# Altium schematic sheet HCM_wiring_diagram.SchDoc
size A; SheetNumber: 2; SheetTotal: 2
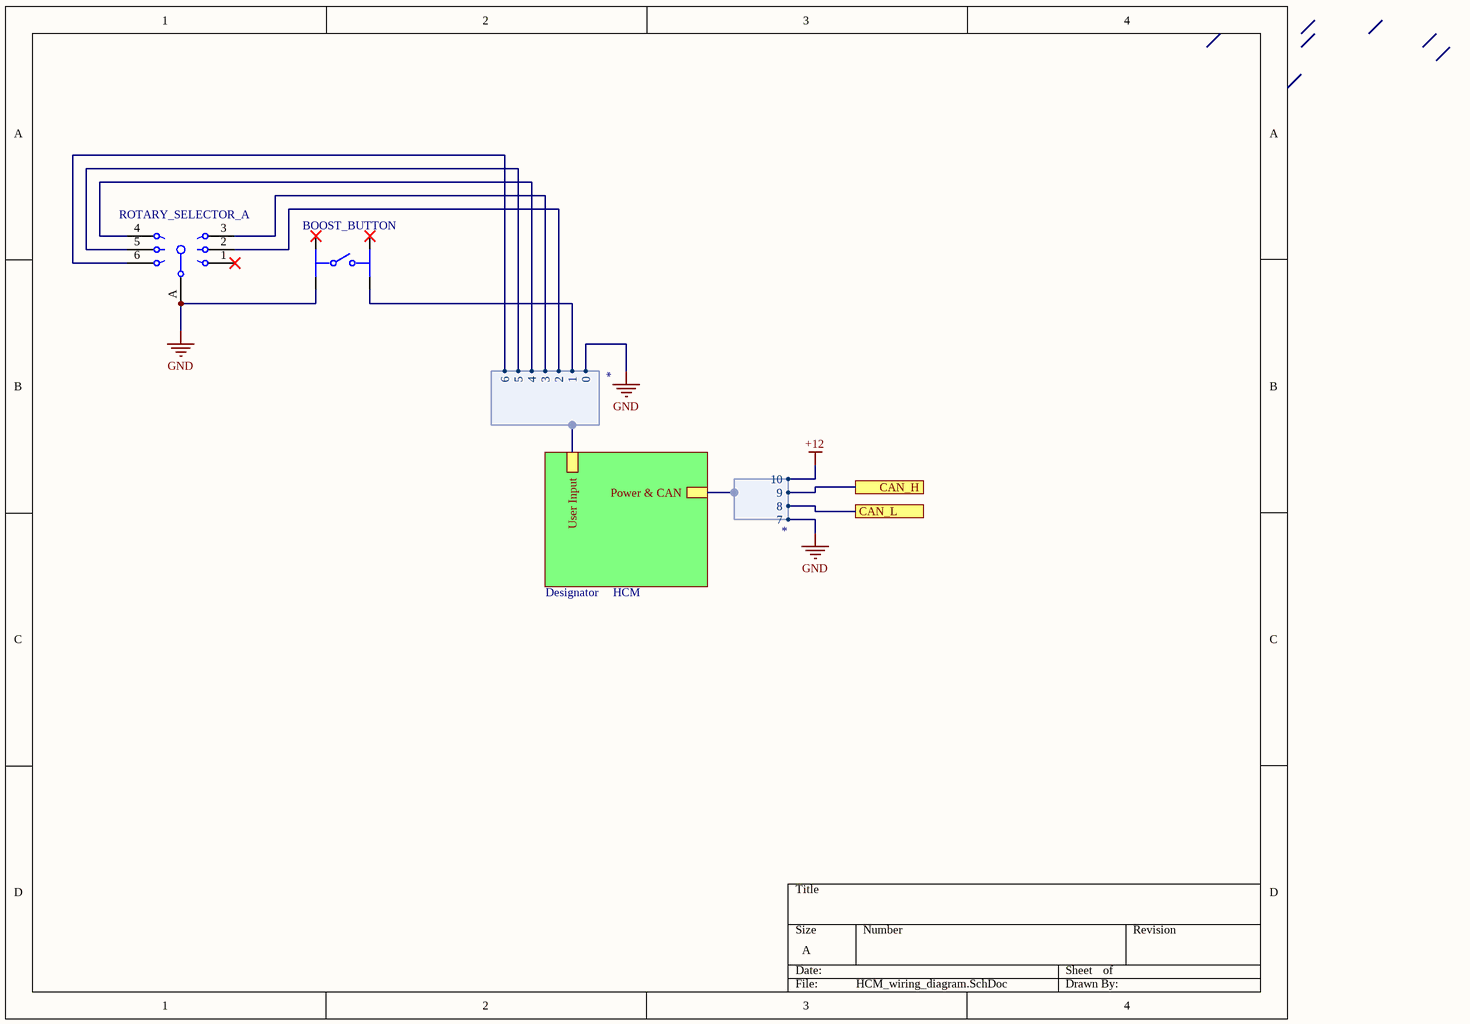
[diagram p0: HCM_wiring_diagram.SchDoc]

## Parts
BOOST_BUTTON  ESE-20C441  [FP-ESE-20C441-MFG]  (value not drawn)
ROTARY_SELECTOR_  A20615RNCQK  [CKCP-A20615RNCQ-14_V]  (value not drawn)  (part A of 2)

## Sub-sheets
Designator = HCM: User Input, Power & CAN

## Ports
CAN_H, CAN_L

## Harnesses
*: 0, 1, 2, 3, 4, 5, 6
*: 7, 8, 9, 10

## Nets
+12: harness *.10
GND: BOOST_BUTTON.C ROTARY_SELECTOR_.A ; harness *.0, harness *.7
CAN_H: port CAN_H, harness *.9
CAN_L: port CAN_L, harness *.8
NetBOOST_BUTTON_D: BOOST_BUTTON.D ; harness *.1
NetROTARY_SELECTOR__2: ROTARY_SELECTOR_.2 ; harness *.2
NetROTARY_SELECTOR__3: ROTARY_SELECTOR_.3 ; harness *.3
NetROTARY_SELECTOR__4: ROTARY_SELECTOR_.4 ; harness *.4
NetROTARY_SELECTOR__5: ROTARY_SELECTOR_.5 ; harness *.5
NetROTARY_SELECTOR__6: ROTARY_SELECTOR_.6 ; harness *.6

Not connected (* = marked no-connect by the designer): BOOST_BUTTON A* B*; ROTARY_SELECTOR_ 1*

## Library data of the parts
BOOST_BUTTON = CMP-05613-000003-1: SWITCH PUSH SPST-NO 0.1A 14V; Throw Configuration: SPST; Current Rating: 100mA; Actuator Type: Lever; Operating Force: 4N; Switch Function: Off-Mom; Actuator Length: 5.5mm; Termination: PC Pin; Series: ESE20C; Max Operating Temperature: 80°C; Package Quantity: 1200; Orientation: Straight; Min Operating Temperature: -30°C; RoHS Compliant: Yes; Mount: Through Hole; REACH SVHC: No SVHC; Voltage Rating (DC): 14V; Contact Current Rating: 100mA; Lead Free: Lead Free; Packaging: Bulk; Radiation Hardening: No; Max Voltage Rating (DC): 14V
ROTARY_SELECTOR_ = CMP-1076-00006-1: A Series Rotary Switch, 2 Poles, 6 Positions, 30 deg Angle of Throw, -30 to 85 degC, RoHS; Manufacturer: C&K Components; Pole: 2; Angle of Throw: 30 deg; Position: 6; Series: A; PackageDescription: 14-Pin Through Hole Device, Dia 26.19 mm, Height 60.59 mm; ComponentLink1URL: http://www.ck-components.com/; ComponentLink2Description: Datasheet; PartNumber: A20615RNCQK; DatasheetVersion: 41821; Temperature Range: -30 to 85 degC; ComponentLink3Description: Package Specification; ComponentLink2URL: http://www.ck-components.com/13397/arotary_9apr14.pdf/; Mounting Technology: Through Hole; PackageReference: A20615RNCQ-14; RoHS: TRUE; ComponentLink1Description: Manufacturer URL; ComponentLink3URL: http://www.ck-components.com/13397/arotary_9apr14.pdf/